# EAGLE design dtmf_v1.2 (EAGLE 9.6.2)
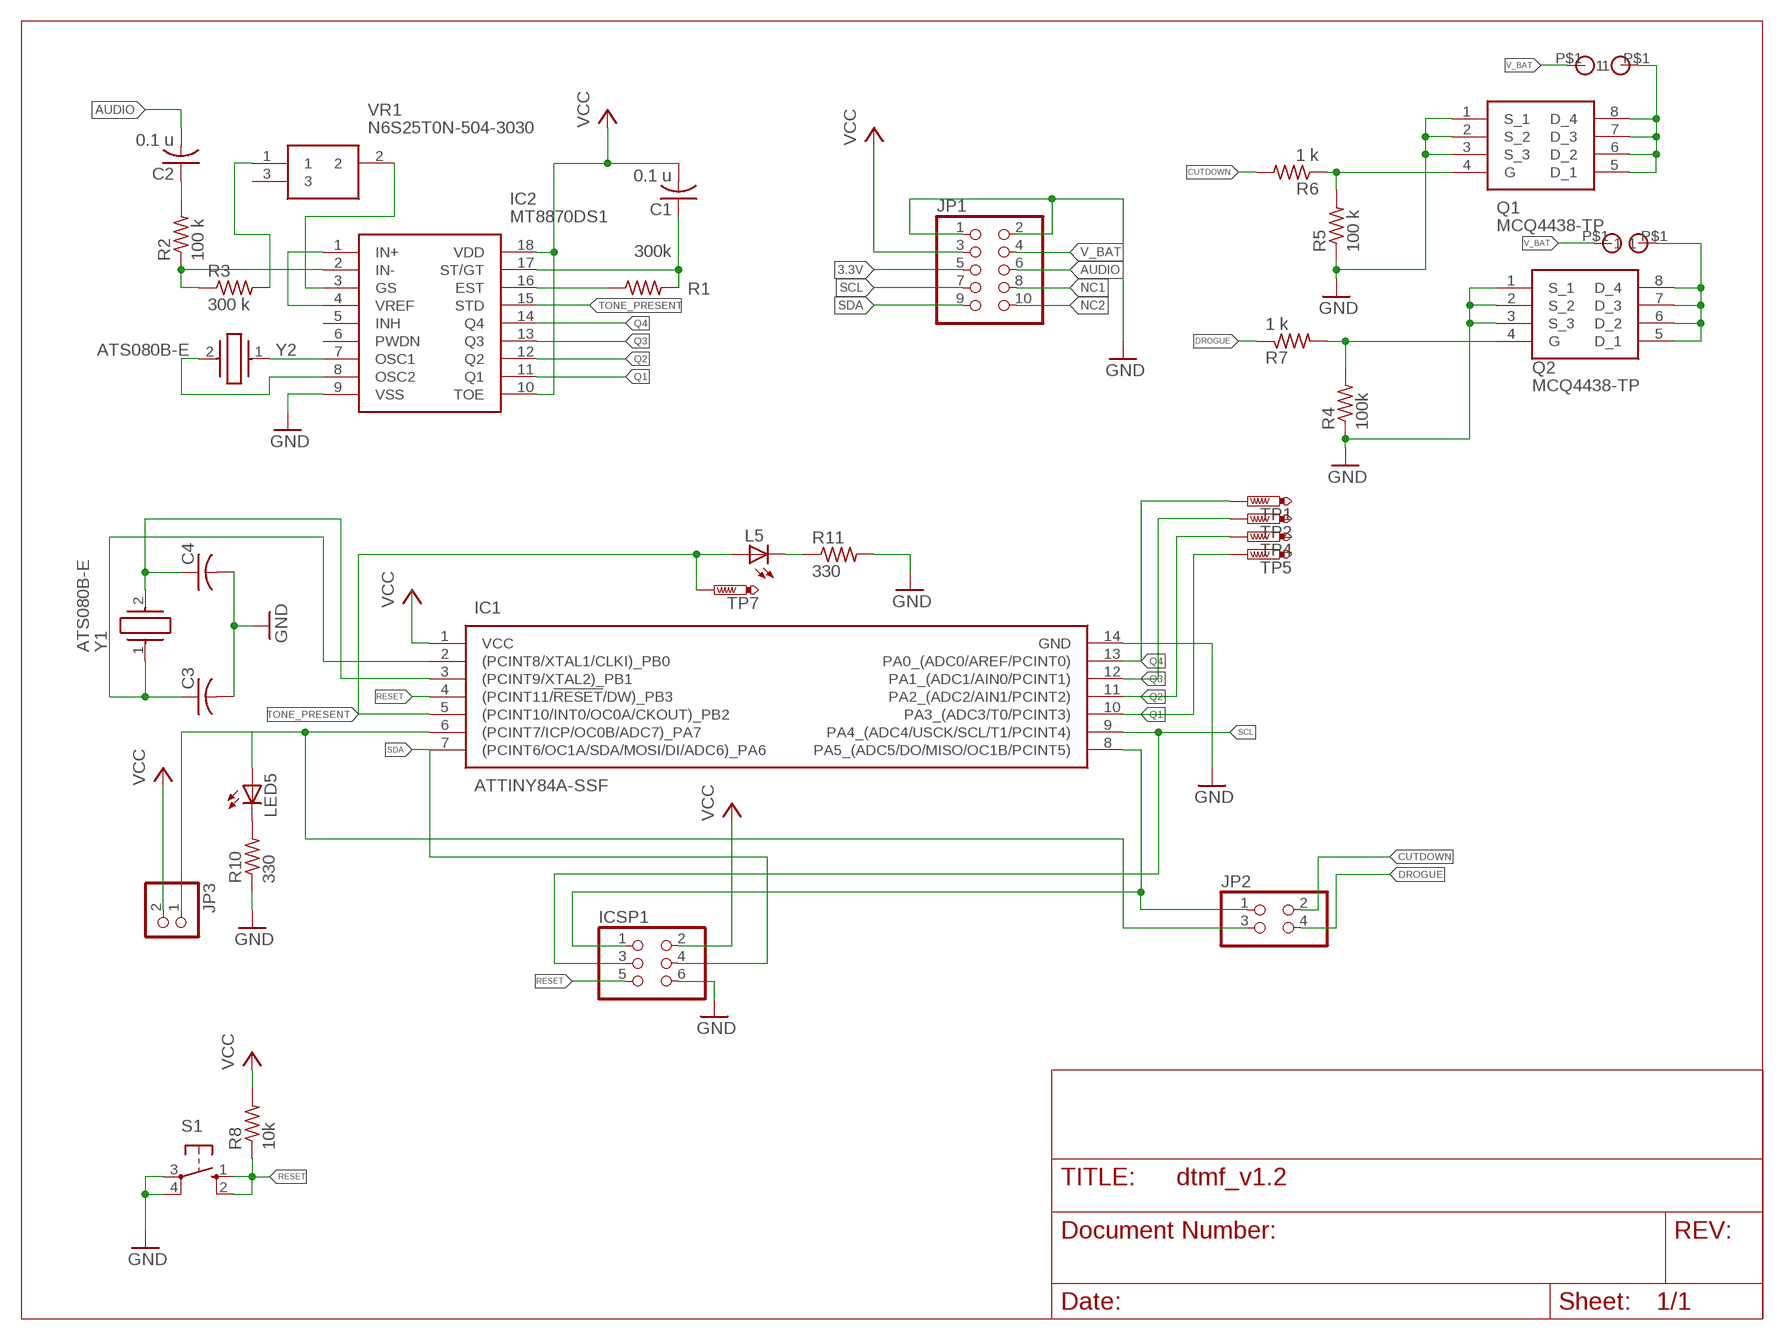
[diagram p0: schematic, sheet 1]

## Parts
C1  0.1 u  C-USC0603  [C0603]
C2  0.1 u  C-USC0603  [C0603]
C3  C-USC0805  [C0805]
C4  C-USC0805  [C0805]
IC1  ATTINY84A-SSF  [SOIC127P600X175-14N]
IC2  MT8870DS1  [SOIC127P1032X265-18N]
ICSP1  PINHD-2X3  [2X03]
JP1  PINHD-2X5  [2X05]
JP2  PINHD-2X2  [2X02]
JP3  PINHD-1X2  [1X02]
L5  LEDCHIP-LED0805  [CHIP-LED0805]
LED5  LEDCHIP-LED0805  [CHIP-LED0805]
Q1  MCQ4438-TP  [SOIC127P600X175-8N]
Q2  MCQ4438-TP  [SOIC127P600X175-8N]
R1  300k  R-US_M0805  [M0805]
R2  100 k  R-US_M0805  [M0805]
R3  300 k  R-US_M0805  [M0805]
R4  100k  R-US_M0805  [M0805]
R5  100 k  R-US_M0805  [M0805]
R6  1 k  R-US_M0805  [M0805]
R7  1 k  R-US_M0805  [M0805]
R8  10k  R-US_0207/10  [0207/10]
R10  330  R-US_M0805  [M0805]
R11  330  R-US_M0805  [M0805]
S1  10-XX  [B3F-10XX]
TP1  PTR1B1,27  [B1,27]
TP2  PTR1B1,27  [B1,27]
TP4  PTR1B1,27  [B1,27]
TP5  PTR1B1,27  [B1,27]
TP7  PTR1B1,27  [B1,27]
U$1  M3_HOLE  [MOUNTING_PAD]
U$2  M3_HOLE  [MOUNTING_PAD]
U$3  M3_HOLE  [MOUNTING_PAD]
U$4  M3_HOLE  [MOUNTING_PAD]
VR1  N6S25T0N-504-3030  [N6S25T0N5043030]
Y1  ATS080B-E  [ATS080BE]
Y2  ATS080B-E  [ATS080BE]

## Nets
3.3V: JP1.5
AUDIO: C2.2 JP1.6
CUTDOWN: JP2.2 R6.2
DROGUE: JP2.4 R7.1
GND [PWR]: C3.2 C4.2 IC1.14(GND) IC2.9(VSS) ICSP1.6 JP1.1 JP1.2 Q1.1(S_1) Q1.2(S_2) Q1.3(S_3) Q2.1(S_1) Q2.2(S_2) Q2.3(S_3) R4.1 R5.1 R10.1 R11.2 S1.3(P) S1.4(P1)
N$1: IC2.7(OSC1) Y2.1
N$2: IC2.8(OSC2) Y2.2
N$3: IC2.1(IN+) IC2.4(VREF)
N$6: Q1.4(G) R5.2 R6.1
N$9: C3.1 IC1.2((PCINT8/XTAL1/CLKI)_PB0) Y1.1
N$10: C4.1 IC1.3((PCINT9/XTAL2)_PB1) Y1.2
N$11: C1.1 IC2.17(ST/GT) R1.2
N$12: IC2.16(EST) R1.1
N$13: R3.2 VR1.1
N$14: IC2.2(IN-) R2.1 R3.1
N$15: C2.1 R2.2
N$16: IC2.3(GS) VR1.2
N$17 [PWR]: Q2.5(D_1) Q2.6(D_2) Q2.7(D_3) Q2.8(D_4) U$4.P$1
N$20 [PWR]: Q1.5(D_1) Q1.6(D_2) Q1.7(D_3) Q1.8(D_4) U$2.P$1
N$22: IC1.6((PCINT7/ICP/OC0B/ADC7)_PA7) JP2.3 JP3.1 LED5.A
N$23: LED5.C R10.2
N$24: IC1.8(PA5_(ADC5/DO/MISO/OC1B/PCINT5)) ICSP1.1 JP2.1
N$25: L5.C R11.1
N$27: Q2.4(G) R4.2 R7.2
NC1: JP1.8
NC2: JP1.10
Q1: IC1.10(PA3_(ADC3/T0/PCINT3)) IC2.11(Q1) TP5.TP
Q2: IC1.11(PA2_(ADC2/AIN1/PCINT2)) IC2.12(Q2) TP4.TP
Q3: IC1.12(PA1_(ADC1/AIN0/PCINT1)) IC2.13(Q3) TP2.TP
Q4: IC1.13(PA0_(ADC0/AREF/PCINT0)) IC2.14(Q4) TP1.TP
RESET: IC1.4((PCINT11/!RESET!/DW)_PB3) ICSP1.5 R8.1 S1.1(S) S1.2(S1)
SCL: IC1.9(PA4_(ADC4/USCK/SCL/T1/PCINT4)) ICSP1.3 JP1.7
SDA: IC1.7((PCINT6/OC1A/SDA/MOSI/DI/ADC6)_PA6) ICSP1.4 JP1.9
TONE_PRESENT: IC1.5((PCINT10/INT0/OC0A/CKOUT)_PB2) IC2.15(STD) L5.A TP7.TP
V_BAT [PWR]: JP1.4 U$1.P$1 U$3.P$1
VCC: C1.2 IC1.1(VCC) IC2.10(TOE) IC2.18(VDD) ICSP1.2 JP1.3 JP3.2 R8.2
Unconnected: IC2.5(INH) IC2.6(PWDN) VR1.3

## Library data of the parts
C1-C4 = rcl:C-US: CAPACITOR, American symbol; SPICEPREFIX: C
IC1 = ATTINY84A-SSF:ATTINY84A-SSF: Atmel ATTINY84A-SSF, 8bit AVR Microcontroller, 20MHz, 8 kB Flash, 14-Pin SOIC Source: Datasheet <http://ww1.microchip.com/downloads/en/DeviceDoc/8183S.pdf>; DESCRIPTION: Atmel ATTINY84A-SSF, 8bit AVR Microcontroller, 20MHz, 8 kB Flash, 14-Pin SOIC; HEIGHT: 1.75mm; MANUFACTURER_NAME: Microchip; MANUFACTURER_PART_NUMBER: ATTINY84A-SSF; MOUSER_PART_NUMBER: 556-ATTINY84A-SSF; MOUSER_PRICE-STOCK: https://www.mouser.co.uk/ProductDetail/Microchip-Technology/ATTINY84A-SSF?qs=TI%2F9gtmDCEG4A0yxcpFhFg%3D%3D
IC2 = MT8870DS1:MT8870DS1: Telecom Interface ICs Pb Free DTMF RECEIVER SOIC Source: Datasheet <http://www.microsemi.com/document-portal/doc_download/127041-mt8870d-datasheet-oct2006>; DESCRIPTION: Telecom Interface ICs Pb Free DTMF RECEIVER SOIC; HEIGHT: 2.65mm; MANUFACTURER_NAME: Microsemi Corporation; MANUFACTURER_PART_NUMBER: MT8870DS1; MOUSER_PART_NUMBER: 494-MT8870DS1; MOUSER_PRICE-STOCK: https://www.mouser.co.uk/ProductDetail/Microchip-Microsemi/MT8870DS1?qs=6jAvgNDGUA8thylXPIiMbQ%3D%3D
ICSP1 = pinhead:PINHD-2X3: PIN HEADER
JP1 = pinhead:PINHD-2X5: PIN HEADER
JP2 = pinhead:PINHD-2X2: PIN HEADER
JP3 = pinhead:PINHD-1X2: PIN HEADER
L5 LED5 = adafruit:LED: LED OSRAM: - CHIPLED LG R971, LG N971, LY N971, LG Q971, LY Q971, LO R971, LY R971 LH N974, LH R974 LS Q976, LO Q976, LY Q976 LO Q996 - Hyper CHIPLED LW Q18S LB Q993, LB Q99A, LB R99A - SideLED LS A670, LO A670, LY A670, LG A670, LP A670 LB A673, LV A673, LT A673, LW A673 LH A674 LY A675 LS A676, LA A676, LO A676, LY A676, LW A676 LS A679, LY A679, LG A679 - Hyper Micro SIDELED® LS Y876, LA Y876, LO Y876, LY Y876 LT Y87S - SmartLED LW L88C, LW L88S LB L89C, LB L89S, LG L890 LS L89K, LO L89K, LY L89K LS L896, LA L896, LO L896, LY L896 - TOPLED LS T670, LO T670, LY T670, LG T670, LP T670 LSG T670, LSP T670, LSY T670, LOP T670, LYG T670 LG T671, LOG T671, LSG T671 LB T673, LV T673, LT T673, LW T673 LH T674 LS T676, LA T676, LO T676, LY T676, LB T676, LH T676, LSB T676, LW T676 LB T67C, LV T67C, LT T67C, LS T67K, LO T67K, LY T67K, LW E67C LS E67B, LA E67B, LO E67B, LY E67B, LB E67C, LV E67C, LT E67C LW T67C LS T679, LY T679, LG T679 LS T770, LO T770, LY T770, LG T770, LP T770 LB T773, LV T773, LT T773, LW T773 LH T774 LS E675, LA E675, LY E675, LS T675 LS T776, LA T776, LO T776, LY T776, LB T776 LHGB T686 LT T68C, LB T68C - Hyper Mini TOPLED® LB M676 - Mini TOPLED Santana® LG M470 LS M47K, LO M47K, LY M47K Source: http://www.osram.convergy.de/
Q1 Q2 = MCQ4438-TP:MCQ4438-TP: Power MOSFETS Source: Datasheet <https://mccsemi.com/pdf/Products/MCQ4438(SOP-8).pdf>; DESCRIPTION: Power MOSFETS; HEIGHT: 1.75mm; MANUFACTURER_NAME: MCC; MANUFACTURER_PART_NUMBER: MCQ4438-TP
R1-R8 R10 R11 = rcl:R-US_: RESISTOR, American symbol; SPICEPREFIX: R
S1 = switch-omron:10-XX: OMRON SWITCH; MPN: B3F-1000; OC_FARNELL: 176432; OC_NEWARK: 36M3542
TP1 TP2 TP4 TP5 TP7 = testpad:PTR1: TEST PIN
U$1-U$4 = KE8TJE:M3_HOLE
VR1 = N6S25T0N-504-3030:N6S25T0N-504-3030: TRIMMER, 500K, 0.1W, 1TURN; Trimpot Type:Single Turn; Element Material:Carbon; Adjustment Type:Side Adjust; Track Resistance:500kohm; Potentiometer Mounting:Through Hole; No. of Turns:1Turns; Product Range:N6 Series; MSL:- RoHS Compliant: Yes Source: Datasheet <https://componentsearchengine.com/Datasheets/1/N6S25T0N-504-3030.pdf>; DESCRIPTION: TRIMMER, 500K, 0.1W, 1TURN; Trimpot Type:Single Turn; Element Material:Carbon; Adjustment Type:Side Adjust; Track Resistance:500kohm; Potentiometer Mounting:Through Hole; No. of Turns:1Turns; Product Range:N6 Series; MSL:- RoHS Compliant: Yes; HEIGHT: 8.7mm; MANUFACTURER_NAME: PIHER; MANUFACTURER_PART_NUMBER: N6S25T0N-504-3030; MOUSER_PART_NUMBER: 531-N6S25T0N5043030; MOUSER_PRICE-STOCK: https://www.mouser.co.uk/ProductDetail/Amphenol-Piher/N6S25T0N-504-3030?qs=byeeYqUIh0NXJQ0IYsWUmQ%3D%3D
Y1 Y2 = ATS080B-E:ATS080B-E: Crystals 8MHz 18pF Fund. -40C +85C Source: Datasheet; DESCRIPTION: Crystals 8MHz 18pF Fund. -40C +85C; HEIGHT: 3.68mm; MANUFACTURER_NAME: CTS; MANUFACTURER_PART_NUMBER: ATS080B-E; MOUSER_PART_NUMBER: 774-ATS080B-E; MOUSER_PRICE-STOCK: https://www.mouser.co.uk/ProductDetail/CTS-Electronic-Components/ATS080B-E?qs=EyvxYzk7Sd1vYvYpN4HpEw%3D%3D

## Net classes
0 default: width 0.254 mm, drill 0.6 mm, clearance 0.381 mm
1 PWR: width 0.889 mm, drill 0.6 mm, clearance 0.381 mm

## Board
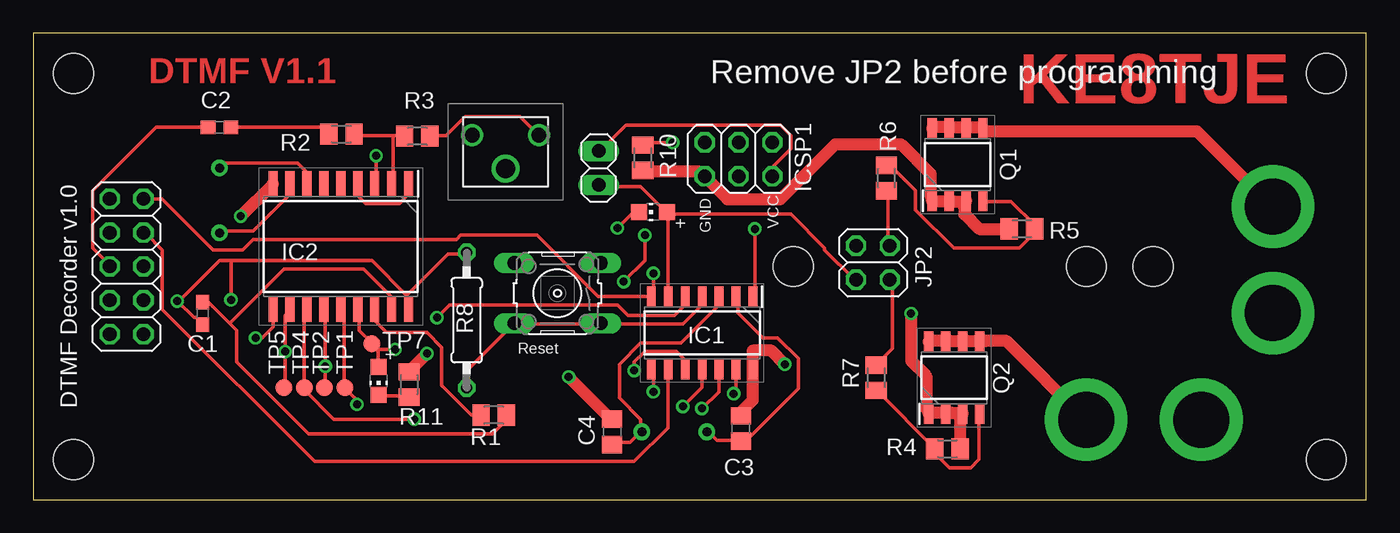
[diagram p1: board, top side]
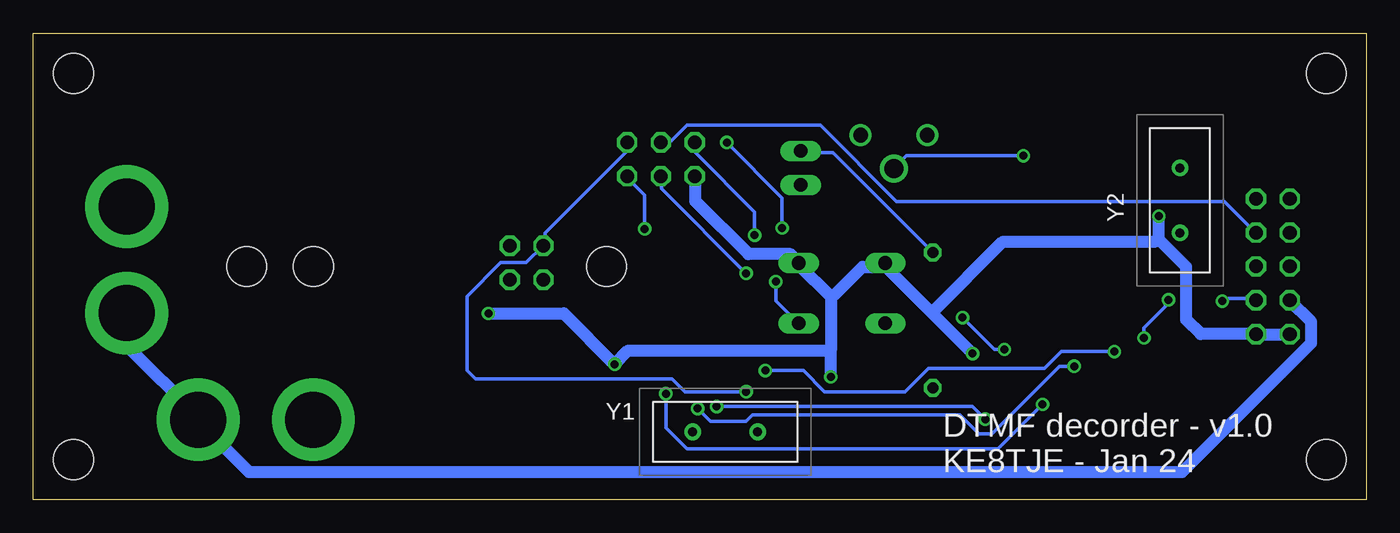
[diagram p2: board, bottom side, seen from below]

Size 100 x 35 mm. Coordinates in mm from the lower left corner, seen from the top.
Outline: 0,0 100,0 100,35 0,35 0,0
Copper layers (1*16): Top 0.035mm / dielectric 1.5mm / Bottom 0.035mm
Design rules "default": minimum track width 6mil, minimum drill 0.35mm, track to track 6mil, track to pad 6mil, pad to pad 6mil, via to via 6mil, smd to smd 6mil, copper to edge 40mil, drill to drill 6mil, minimum pad ring 10mil, minimum via ring 8mil, stop-mask expansion 4mil, vias tented up to drill 0mil, thermal gap 10mil
Holes 3 mm at 3,3 57,17.5 3,32 97,32 97,3 79,17.5 84,17.5

### Footprints (pad centres in the part's own frame; a part is rotated, then mirrored left to right if it is on the bottom)
C0603 = smd 1.1 x 1: 1 -0.85,0; 2 0.85,0
C0805 = smd 1.3 x 1.5: 1 -0.95,0; 2 0.95,0
SOIC127P600X175-14N = smd 1.528 x 0.65: 1 -2.711,3.81; 2 -2.711,2.54; 3 -2.711,1.27; 4 -2.711,0; 5 -2.711,-1.27; 6 -2.711,-2.54; 7 -2.711,-3.81; 8 2.711,-3.81; 9 2.711,-2.54; 10 2.711,-1.27; 11 2.711,0; 12 2.711,1.27; 13 2.711,2.54; 14 2.711,3.81
SOIC127P1032X265-18N = smd 1.925 x 0.7: 1 -4.712,5.08; 2 -4.712,3.81; 3 -4.712,2.54; 4 -4.712,1.27; 5 -4.712,0; 6 -4.712,-1.27; 7 -4.712,-2.54; 8 -4.712,-3.81; 9 -4.712,-5.08; 10 4.712,-5.08; 11 4.712,-3.81; 12 4.712,-2.54; 13 4.712,-1.27; 14 4.712,0; 15 4.712,1.27; 16 4.712,2.54; 17 4.712,3.81; 18 4.712,5.08
2X03 = drill 1.016 octagon: 1 -2.54,-1.27; 2 -2.54,1.27; 3 0,-1.27; 4 0,1.27; 5 2.54,-1.27; 6 2.54,1.27
2X05 = drill 1.016 octagon: 1 -5.08,-1.27; 2 -5.08,1.27; 3 -2.54,-1.27; 4 -2.54,1.27; 5 0,-1.27; 6 0,1.27; 7 2.54,-1.27; 8 2.54,1.27; 9 5.08,-1.27; 10 5.08,1.27
2X02 = drill 1.016 octagon: 1 -1.27,-1.27; 2 -1.27,1.27; 3 1.27,-1.27; 4 1.27,1.27
1X02 = drill 1.016 long: 1 -1.27,0; 2 1.27,0
CHIP-LED0805 = smd 1.2 x 1.2: A 0,-1.05; C 0,1.05
SOIC127P600X175-8N = smd 1.525 x 0.7: 1 -2.712,1.905; 2 -2.712,0.635; 3 -2.712,-0.635; 4 -2.712,-1.905; 5 2.712,-1.905; 6 2.712,-0.635; 7 2.712,0.635; 8 2.712,1.905
M0805 = smd 1.3 x 1.6: 1 -0.95,0; 2 0.95,0
0207/10 = drill 0.813 octagon: 1 -5.08,0; 2 5.08,0
B3F-10XX = drill 1.016 long: 1 -3.251,2.261; 2 3.251,2.261; 3 -3.251,-2.261; 4 3.251,-2.261
B1,27 = smd 1.27 x 1.27: TP 0,0
MOUNTING_PAD = drill 4.2 pad 6.2: P$1 0,0
N6S25T0N5043030 = drill 1.1 pad 1.65: 1 0,0; 3 5,0 | drill 1.4 pad 2.1: 2 2.5,2.5
ATS080BE = drill 0.68 pad 1.247: 1 0,0; 2 4.88,0

### Placement (x,y rotation side)
C1  12.7,13.97 270 top
C2  13.97,27.94 180 top
C3  53.09,5.33 90 top
C4  43.43,5.08 90 top
IC1  50.18,12.5 270 top
IC2  23.07,18.99 270 top
ICSP1  52.91,25.55 180 top
JP1  7,17.5 90 top
JP2  62.99,17.78 270 top
JP3  42.42,24.89 90 top
L5  25.91,8.89 180 top
LED5  46.48,21.59 90 top
Q1  69.34,25.15 90 top
Q2  69.09,9.14 90 top
R1  34.54,6.35 0 top
R2  23.11,27.43 180 top
R3  28.81,27.28 0 top
R4  68.58,3.81 180 top
R5  74.17,20.32 0 top
R6  64.01,24.13 270 top
R7  63.25,9.14 270 top
R8  32.51,13.46 90 top
R10  45.72,25.65 90 top
R11  28.19,8.64 90 top
S1  39.32,15.49 180 top
TP1  23.37,8.38 0 top
TP2  21.84,8.38 0 top
TP4  20.32,8.38 0 top
TP5  18.8,8.38 0 top
TP7  25.4,11.68 0 top
U$1  93,14 0 top
U$2  93,22 0 top
U$3  87.63,6 0 top
U$4  78.99,6 0 top
VR1  37.93,27.35 180 top
Y1  50.53,5.09 0 bottom
Y2  13.97,24.89 270 bottom

### Tracks (layer width: path | path; a pad name or v marks a point on that pad's centre or on a via)
AUDIO
  Top 0.254: C2.2 9.21,27.94 4.45,23.18 4.45,18.89 5.71,17.62 JP1.6
CUTDOWN
  Top 0.254: R6.2 64.14,23.18 64.14,19.05 JP2.2
DROGUE
  Top 0.254: R7.1 64.45,11.35 64.45,16.35 64.29,16.51 JP2.4
GND  (via drill 0.6)
  Top 0.889: R5.1 70.96,20.32 69.85,21.43 69.85,21.91 Q1.3 69.85,22.38 69.06,22.38 Q1.2 68.58,22.38 67.47,22.38 Q1.1 67.31,22.86 67.31,24.45 65.09,26.67 60.17,26.67 56.04,22.54 52.07,22.54 50.64,23.97 ICSP1.6 50.32,24.29 50.01,24.61 45.72,24.61 R10.1 | v15.56,21.27 17.94,23.65 IC2.9 | v29.53,10.95 28.26,9.68 R11.2 | R4.1 69.53,6.03 Q2.3 69.69,6.51 68.9,6.51 Q2.2 68.42,6.51 67.31,6.51 Q2.1 66.99,6.83 66.99,9.27 65.85,10.41 v65.85,13.97 | C3.2 53.18,6.35 53.18,6.67 53.99,7.47 IC1.14 53.99,11.18 55.37,11.18 v56.39,10.16 | v40.16,9.21 43.34,6.03 C4.2
  Bottom 0.889: 15.56,19.53 v15.56,21.27 | JP1.2 5.87,12.38 7.94,12.38 JP1.1 12.42,12.42 13.5,13.5 13.5,17.47 15.56,19.53 | 32.59,14.02 36.2,17.62 S1.4 36.51,17.46 37.78,17.46 39.85,15.4 40.16,15.24 | 32.59,14.02 v29.53,10.95 | 40.16,15.24 40.16,11.18 | 40.16,15.24 42.55,17.62 S1.3 42.86,18.1 43.18,18.41 46.35,18.41 50.32,22.38 50.32,24.13 ICSP1.6 | 40.16,11.18 55.37,11.18 v56.39,10.16 60.2,13.97 v65.85,13.97 | 32.59,14.02 27.24,19.37 15.88,19.37 15.56,19.53 | v40.16,9.21 40.16,11.18
N$1
  Top 0.254: IC2.7 20.48,23.81 20.48,24.61 19.84,25.24 14.29,25.24 13.97,24.92 Y2.1
N$2
  Top 0.254: IC2.8 19.21,23.65 19.21,22.86 16.51,20.16 13.97,20.16 Y2.2
N$3
  Top 0.254: IC2.4 24.45,23.65 24.45,22.7 24.92,22.23 27.46,22.23 28.1,22.86 28.1,23.65 IC2.1
N$6
  Top 0.254: 75.09,20.32 75.09,20.64 73.34,22.38 71.28,22.38 Q1.4 | 75.09,20.32 75.09,20 73.98,18.89 69.06,18.89 66.2,21.75 66.2,23.18 64.45,24.92 64.14,24.92 R6.1 | 75.09,20.32 R5.2
N$9
  Top 0.254: Y1.1 50.64,5.08 51.28,4.45 53.02,4.45 C3.1 53.18,4.45 53.5,4.45 57.4,8.35 57.4,10.58 55.85,12.13 54.74,12.13 52.86,14 52.86,15.08 IC1.2
N$10
  Top 0.254: C4.1 43.5,4.29 44.77,4.29 45.56,5.08 Y1.2 45.56,5.24 45.56,6.03 43.97,7.62 43.97,10.16 45.56,11.75 48.58,11.75 51.44,14.61 51.44,15.08 IC1.3
N$11
  Top 0.254: 12.7,14.92 C1.1 13.12,14.82 14.73,13.21 | IC2.17 26.83,14.29 26.83,15.24 24.77,17.3 21.34,17.3 18.83,17.3 14.73,13.21 | R1.2 35.4,6.35 35.4,5.87 34.45,4.92 20.64,4.92 15.24,10.32 15.24,12.7 14.73,13.21
N$12
  Top 0.254: R1.1 32.86,6.35 30.64,8.57 30.64,11.43 29.53,12.54 26.51,12.54 25.72,13.34 25.72,14.13 IC2.16
N$13
  Top 0.254: R3.2 29.84,27.3 30.96,27.3 32.38,28.73 36.51,28.73 37.78,27.46 VR1.1
N$14
  Top 0.254: 26.99,27.3 27.78,27.3 R3.1 | 26.99,27.3 24.13,27.3 R2.1 | 26.99,27.3 26.99,23.81 IC2.2
N$15
  Top 0.254: C2.1 21.59,27.94 22.07,27.46 R2.2
N$16  (via drill 0.6)
  Top 0.254: v25.72,25.81 25.72,23.81 IC2.3
  Bottom 0.254: v25.72,25.81 34.51,25.81 35.4,24.92 VR1.2
N$17
  Top 0.889: Q2.8 67.31,11.91 68.42,11.91 Q2.7 68.9,11.91 69.69,11.91 Q2.6 70.17,11.91 70.96,11.91 Q2.5 71.44,11.91 73.03,11.91 78.9,6.03 U$4.P$1
N$20
  Top 0.889: Q1.8 67.47,27.94 68.58,27.94 Q1.7 69.06,27.94 69.85,27.94 Q1.6 70.33,27.94 71.12,27.94 Q1.5 71.6,27.62 87.31,27.62 92.87,22.07 U$2.P$1
N$22
  Top 0.254: LED5.A 47.47,21.59 45.56,23.5 42.55,23.5 JP3.1 | 47.62,21.43 47.62,21.59 LED5.A | 47.62,21.43 47.62,15.24 IC1.6 | 47.62,21.43 56.83,21.43 59.37,18.89 59.37,18.73 61.59,16.51 JP2.3 | 47.62,21.43 LED5.A
N$23  (via drill 0.6)
  Top 0.254: LED5.C 45.02,21.59 v43.81,20.38 | R10.2 45.91,26.8 v47.97,26.8
  Bottom 0.254: v43.81,20.38 43.81,22.64 v47.97,26.8
N$24  (via drill 0.6)
  Top 0.254: v46.51,8.1 46.51,9.68 IC1.8
  Bottom 0.254: v46.51,8.1 51.12,8.1 52.07,9.05 66.83,9.05 67.47,9.68 67.47,15.24 64.93,17.78 63.02,17.78 61.75,19.05 JP2.1 61.59,19.05 61.59,20 55.56,26.04 55.56,26.67 ICSP1.1
N$25
  Top 0.254: L5.C 26.04,7.78 28.1,7.78 R11.1
N$27
  Top 0.254: Q2.4 70.96,6.35 70.96,3.02 70.33,2.38 68.74,2.38 67.79,3.33 67.79,3.81 R4.2 63.28,8.19 R7.2
Q1  (via drill 0.6)
  Top 0.254: TP5.TP 18.89,8.41 v18.89,11.11 18.89,13.81 19.21,14.13 IC2.11 | v45.09,9.68 45.09,10.32 45.88,11.11 48.26,11.11 48.9,10.48 48.9,9.84 IC1.10
  Bottom 0.254: v45.09,9.68 42.23,9.68 40.64,8.1 34.61,8.1 32.86,9.84 24.13,9.84 22.86,11.11 v18.89,11.11
Q2  (via drill 0.6)
  Top 0.254: IC2.12 20.48,14.13 20.32,13.97 TP4.TP 20.32,8.26 22.54,6.03 v28.57,6.03 | v48.74,6.99 50.16,8.41 50.16,9.68 IC1.11
  Bottom 0.254: v48.74,6.99 29.53,6.99 v28.57,6.03
Q3  (via drill 0.6)
  Top 0.254: TP2.TP 21.91,8.41 v21.91,10 21.91,14.13 IC2.13 | v50.16,6.83 51.44,8.1 51.44,9.68 IC1.12
  Bottom 0.254: v50.16,6.83 49.21,5.87 46.51,5.87 46.04,6.35 30.48,6.35 29.05,4.92 28.1,4.92 23.02,10 v21.91,10
Q4  (via drill 0.6)
  Top 0.254: IC2.14 23.18,14.13 23.34,13.97 23.34,8.41 TP1.TP 24.29,7.46 v24.29,7.14 | v52.55,7.94 52.7,8.1 52.7,9.68 IC1.13
  Bottom 0.254: v52.55,7.94 52.55,5.4 50.96,3.81 27.62,3.81 v24.29,7.14
RESET  (via drill 0.6)
  Top 0.254: R8.1 32.54,8.41 32.54,9.68 36.04,13.18 S1.2 36.2,13.18 42.55,13.18 S1.1 42.7,13.18 48.74,13.18 50.16,14.61 50.16,15.08 IC1.4 | v45.88,19.84 45.88,17.94 v44.29,16.35
  Bottom 0.254: v45.88,19.84 45.88,21.59 50.32,26.04 50.32,26.67 ICSP1.5 | v44.29,16.35 44.29,14.92 42.7,13.34 S1.1
SCL
  Top 0.254: IC1.9 47.62,9.68 47.62,5.4 45.09,2.86 21.11,2.86 9.68,14.29 9.68,18.73 8.41,20 JP1.7
  Bottom 0.254: ICSP1.3 52.86,26.83 52.23,26.83 50.96,28.1 40.96,28.1 35.24,22.38 10.64,22.38 8.41,20.16 JP1.7
SDA  (via drill 0.6)
  Top 0.254: v46.51,16.99 46.51,15.24 IC1.7 46.35,15.24 42.39,15.24 37.78,19.84 32.07,19.84 31.75,19.53 16.51,19.53 15.72,18.73 13.49,18.73 9.68,22.54 8.41,22.54 JP1.9
  Bottom 0.254: v46.51,16.99 52.86,23.34 52.86,24.13 ICSP1.4
TONE_PRESENT  (via drill 0.6)
  Top 0.254: L5.A 25.88,10 25.88,11.11 25.4,11.59 TP7.TP | v30.29,13.65 31.24,14.61 43.81,14.61 44.61,13.81 48.1,13.81 48.9,14.61 48.9,15.08 IC1.5 | v27.15,11.27 25.88,11.27 TP7.TP | IC2.15 24.45,14.13 24.45,12.7 25.4,11.75 TP7.TP
  Bottom 0.254: v27.15,11.27 27.91,11.27 v30.29,13.65
V_BAT
  Bottom 0.889: JP1.4 5.71,14.92 4.13,13.34 4.13,11.75 13.81,2.06 83.82,2.06 87.63,5.87 U$3.P$1 87.79,6.35 92.87,11.43 92.87,13.97 U$1.P$1
VCC  (via drill 0.6)
  Top 0.254: v54.13,20.32 54.13,15.24 IC1.1 | 10.87,14.84 12.06,13.65 12.22,13.65 12.7,13.18 C1.2 | 10.87,14.84 13.97,17.94 14.83,17.94 | 10.87,14.84 10.86,14.83 v10.79,14.89 | 14.83,17.94 25.4,17.94 28.02,15.32 | 28.02,15.32 28.1,15.24 28.1,14.29 IC2.18 | 14.83,17.94 v14.83,14.99 | IC2.10 17.99,12.94 17.18,12.13 v16.67,12.13 | 28.02,15.32 31.11,18.41 32.38,18.41 R8.2 | ICSP1.2 55.56,24.29 55.56,25.08 56.83,26.35 56.83,27.3 56.04,28.1 44.45,28.1 42.55,26.19 JP3.2
  Bottom 0.254: v54.13,20.32 54.13,22.86 55.4,24.13 ICSP1.2 | v14.83,14.99 15.08,14.73 15.08,14.48 16.67,12.89 v16.67,12.13 | v10.79,14.89 10.6,15.08 8.41,15.08 JP1.3 | R8.2 40.01,26.04 42.39,26.04 JP3.2

### Text on the board
Top: DTMF V1.1 | KE8TJE
tPlace: GND | VCC | Reset | DTMF Decorder v1.0
tNames: Remove JP2 before programming
bNames: DTMF decorder - v1.0 / KE8TJE - Jan 24